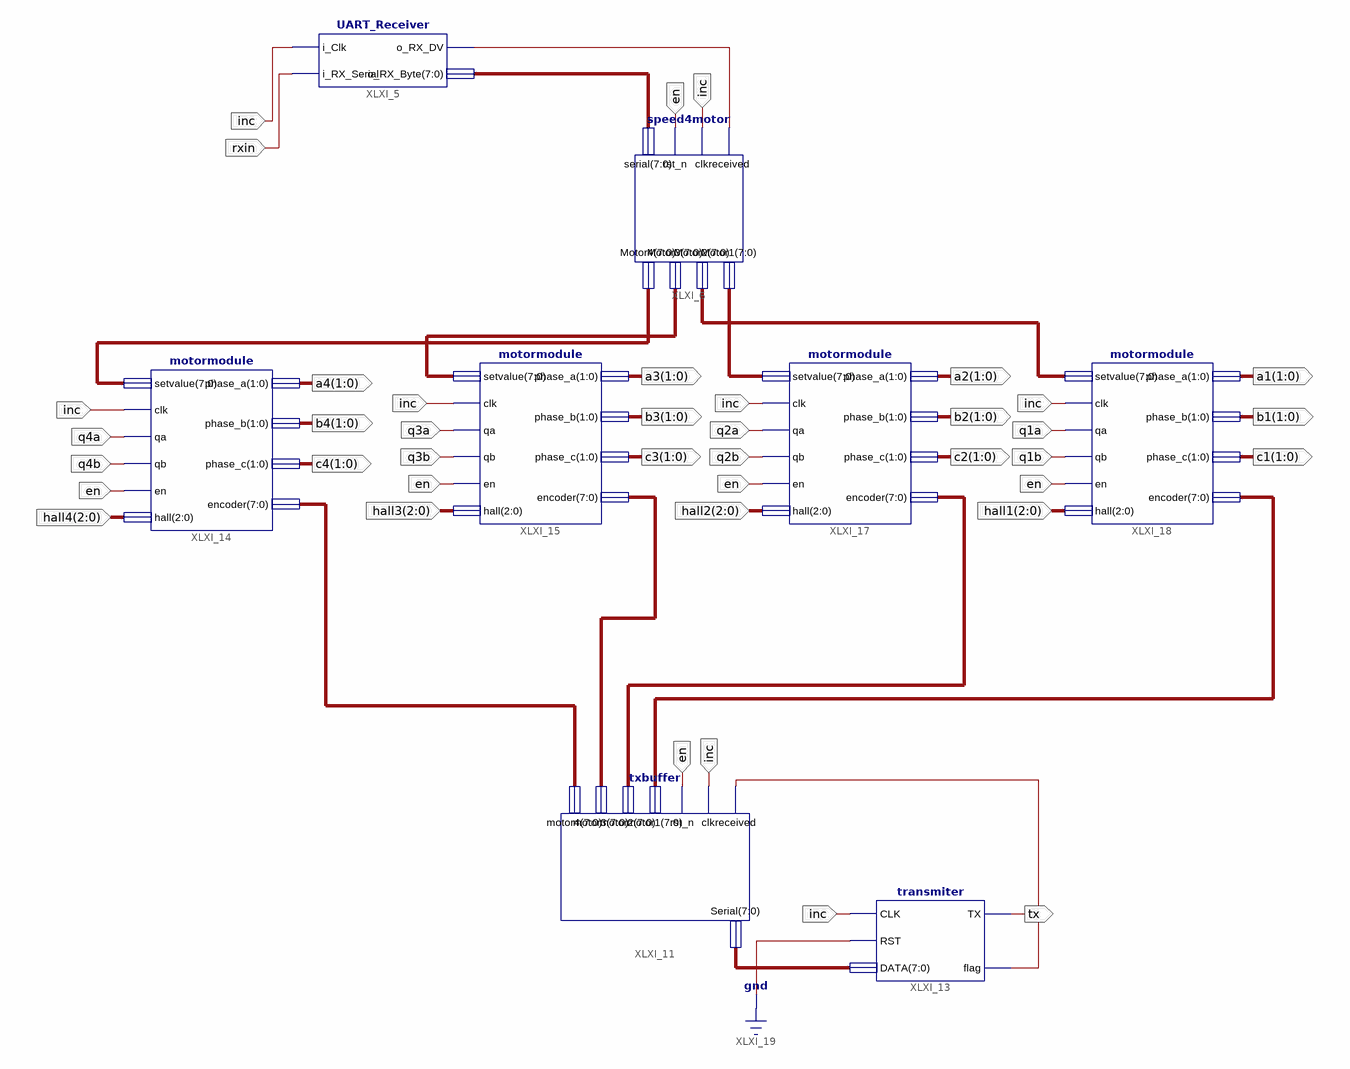
[diagram p0: schematic sheet 1]
// Xilinx ISE schematic motorpackage.sch (spartan6) as structural Verilog: 8 symbols, 28 ports
module motorpackage (
  input  inc,
  input  rxin,
  input  en,
  input  q4a,
  input  q4b,
  input  q3a,
  input  q3b,
  input  q2a,
  input  q2b,
  input  q1a,
  input  q1b,
  input  [2:0] hall1,
  input  [2:0] hall2,
  input  [2:0] hall3,
  input  [2:0] hall4,
  output tx,
  output [1:0] a4,
  output [1:0] b4,
  output [1:0] c4,
  output [1:0] a1,
  output [1:0] b1,
  output [1:0] c1,
  output [1:0] a3,
  output [1:0] b3,
  output [1:0] c3,
  output [1:0] a2,
  output [1:0] b2,
  output [1:0] c2
);

  wire XLXN_1, XLXN_38;
  wire [7:0] XLXN_2, XLXN_39, XLXN_41, XLXN_43, XLXN_44, XLXN_45, XLXN_73, XLXN_74, XLXN_75, XLXN_76;

  UART_Receiver XLXI_5 (.i_Clk(inc), .i_RX_Serial(rxin), .o_RX_DV(XLXN_1), .o_RX_Byte(XLXN_2));
  speed4motor XLXI_6 (
    .received(XLXN_1), .clk(inc), .rst_n(en), .serial(XLXN_2), .Motor1(XLXN_73), .Motor2(XLXN_74),
    .Motor3(XLXN_75), .Motor4(XLXN_76));
  txbuffer XLXI_11 (
    .received(XLXN_38), .clk(inc), .rst_n(en), .motor1(XLXN_41), .motor2(XLXN_43), .motor3(XLXN_44),
    .motor4(XLXN_45), .Serial(XLXN_39));
  transmiter XLXI_13 (.CLK(inc), .RST(1'b0), .DATA(XLXN_39), .TX(tx), .flag(XLXN_38));
  motormodule XLXI_14 (
    .setvalue(XLXN_76), .clk(inc), .qa(q4a), .qb(q4b), .en(en), .hall(hall4), .phase_a(a4), .phase_b(b4),
    .phase_c(c4), .encoder(XLXN_45));
  motormodule XLXI_15 (
    .setvalue(XLXN_75), .clk(inc), .qa(q3a), .qb(q3b), .en(en), .hall(hall3), .phase_a(a3), .phase_b(b3),
    .phase_c(c3), .encoder(XLXN_44));
  motormodule XLXI_17 (
    .setvalue(XLXN_73), .clk(inc), .qa(q2a), .qb(q2b), .en(en), .hall(hall2), .phase_a(a2), .phase_b(b2),
    .phase_c(c2), .encoder(XLXN_43));
  motormodule XLXI_18 (
    .setvalue(XLXN_74), .clk(inc), .qa(q1a), .qb(q1b), .en(en), .hall(hall1), .phase_a(a1), .phase_b(b1),
    .phase_c(c1), .encoder(XLXN_41));
endmodule
